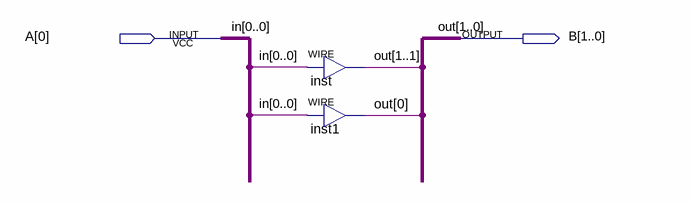
[diagram p0: schematic sheet]
// Quartus schematic copyer_2b.bdf as structural Verilog: 2 symbols, 2 pins
module copyer_2b (
  input  [0:0] A,
  output [1:0] B
);

  assign B[1] = A[0];  // WIRE inst
  assign B[0] = A[0];  // WIRE inst1

  // Other names for the same wires on the sheet: in[0] = A[0]; out[1:0] = B
endmodule
